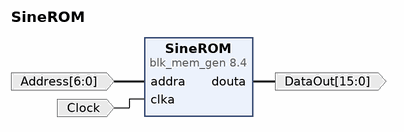
[diagram p0: block diagram of the top level]
# Vivado block design SineROM, xc7z010clg400-1, Vivado 2019.2
create_bd_design SineROM

create_bd_port -dir I -from 6 -to 0 Address
create_bd_port -dir O -from 15 -to 0 DataOut
create_bd_port -dir I -type clk Clock
set_property -dict {CONFIG.FREQ_HZ 125000000} [get_bd_ports Clock]

create_bd_cell -type ip -vlnv xilinx.com:ip:blk_mem_gen:8.4 SineROM
set_property -dict [list \
  CONFIG.Coe_File ../../../../../../SineWave.coe \
  CONFIG.Enable_32bit_Address false \
  CONFIG.Enable_A Always_Enabled \
  CONFIG.Fill_Remaining_Memory_Locations true \
  CONFIG.Load_Init_File true \
  CONFIG.Memory_Type Single_Port_ROM \
  CONFIG.Port_A_Write_Rate 0 \
  CONFIG.Register_PortA_Output_of_Memory_Primitives true \
  CONFIG.Use_RSTA_Pin false \
  CONFIG.Write_Depth_A 100 \
  CONFIG.Write_Width_A 16 \
  CONFIG.use_bram_block Stand_Alone \
] [get_bd_cells SineROM]

# ---- connections ----

connect_bd_net -net addra_0_1 [get_bd_ports Address] [get_bd_pins SineROM/addra]
connect_bd_net [get_bd_pins SineROM/douta] [get_bd_ports DataOut]
connect_bd_net -net clka_0_1 [get_bd_ports Clock] [get_bd_pins SineROM/clka]

validate_bd_design
save_bd_design
